# Altium schematic sheet LED.SchDoc
size A
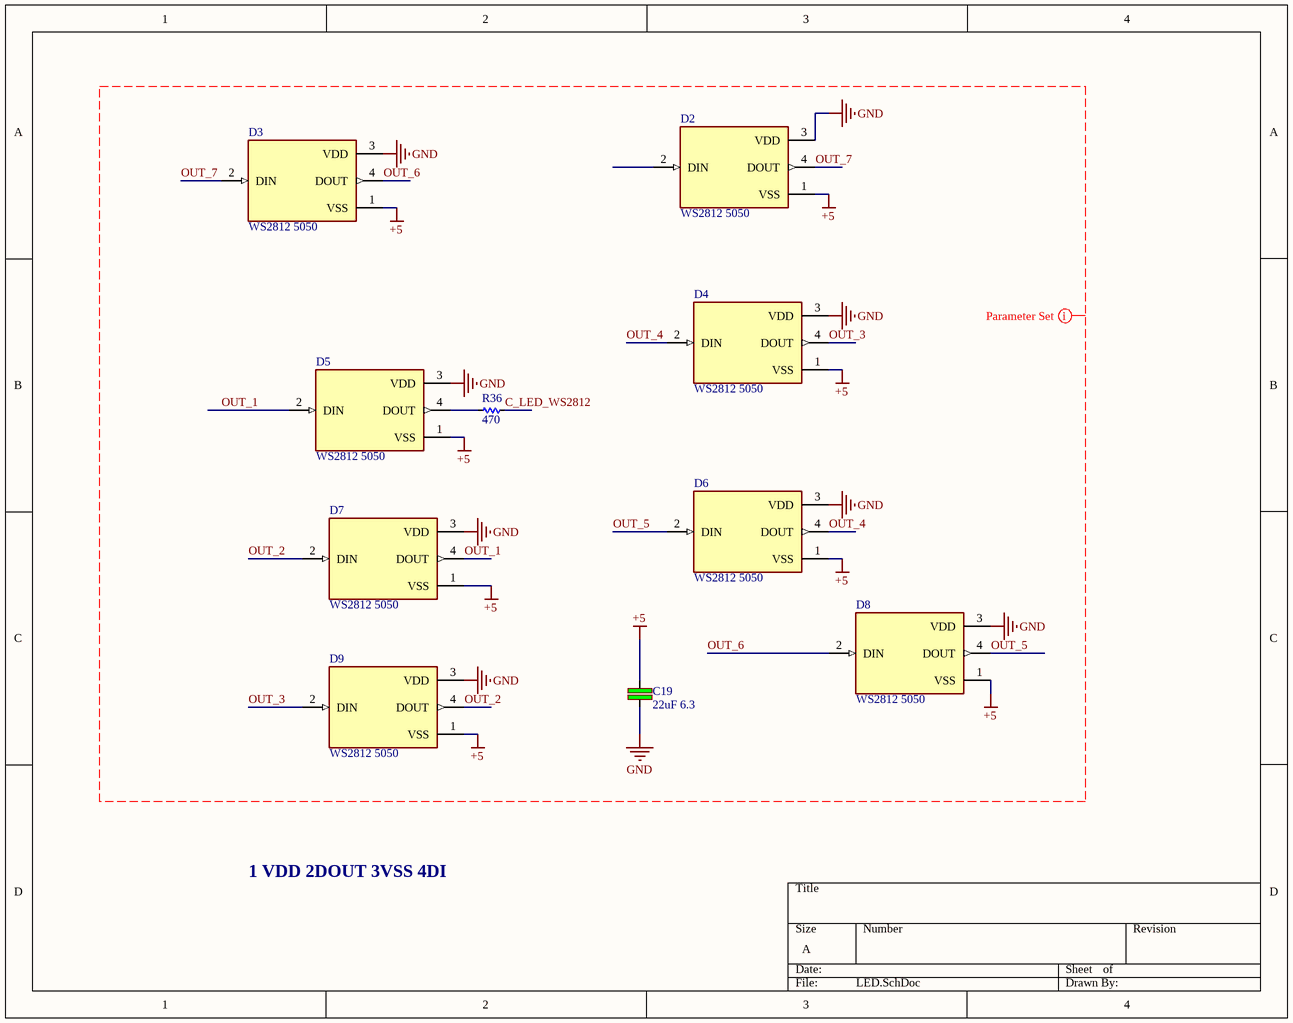
[diagram p0: LED.SchDoc]

## Parts
C19  22uF 6.3  [CN-SMD-1206]
D2  WS2812 5050  [LED_1655]
D3  WS2812 5050  [LED_1655]
D4  WS2812 5050  [LED_1655]
D5  WS2812 5050  [LED_1655]
D6  WS2812 5050  [LED_1655]
D7  WS2812 5050  [LED_1655]
D8  WS2812 5050  [LED_1655]
D9  WS2812 5050  [LED_1655]
R36  470  [RES-SMD-0603]

## Nets
+5: C19.2 D2.1(VSS) D3.1(VSS) D4.1(VSS) D5.1(VSS) D6.1(VSS) D7.1(VSS) D8.1(VSS) D9.1(VSS)
GND: C19.1 D2.3(VDD) D3.3(VDD) D4.3(VDD) D5.3(VDD) D6.3(VDD) D7.3(VDD) D8.3(VDD) D9.3(VDD)
C_LED_WS2812: R36.1
OUT_1: D5.2(DIN) D7.4(DOUT)
OUT_2: D7.2(DIN) D9.4(DOUT)
OUT_3: D4.4(DOUT) D9.2(DIN)
OUT_4: D4.2(DIN) D6.4(DOUT)
OUT_5: D6.2(DIN) D8.4(DOUT)
OUT_6: D3.4(DOUT) D8.2(DIN)
OUT_7: D2.4(DOUT) D3.2(DIN)
NetD5_4: D5.4(DOUT) R36.2

Not connected (* = marked no-connect by the designer): D2 2(DIN)

## Layout directives
net class LED: +5, C_LED_WS2812, GND, OUT_1, OUT_2, OUT_3, OUT_4, OUT_5, OUT_6, OUT_7

## Notes on the sheet
- 1 VDD 2DOUT 3VSS 4DI

## Library data of the parts
C19 = C: Cap SMD 1206 >5V; Value: 103
D2-D9 = 1655: Addressable Lighting Neopixel 10 LED Discrete Serial _Shift Register_ Red, Green, Blue _RGB_ 5.00mm L x 5.00mm W; MF: Adafruit Industries; Value: *; SnapEDA_Link: https://www.snapeda.com/parts/1655/Adafruit%20Industries%20LLC/view-part/53433/?ref=snap; Price: None; Availability: Unavailable; Package: TSOP-38238 Adafruit Industries; MP: 1655
R36 = Res-SMD: Resistor; Manufacturer: Generic Components; Class: Passive; Published: 08/06/2000; Publisher: Altium Hobart Technology Centre